# EAGLE design IR_blaster (EAGLE 7.6.0)
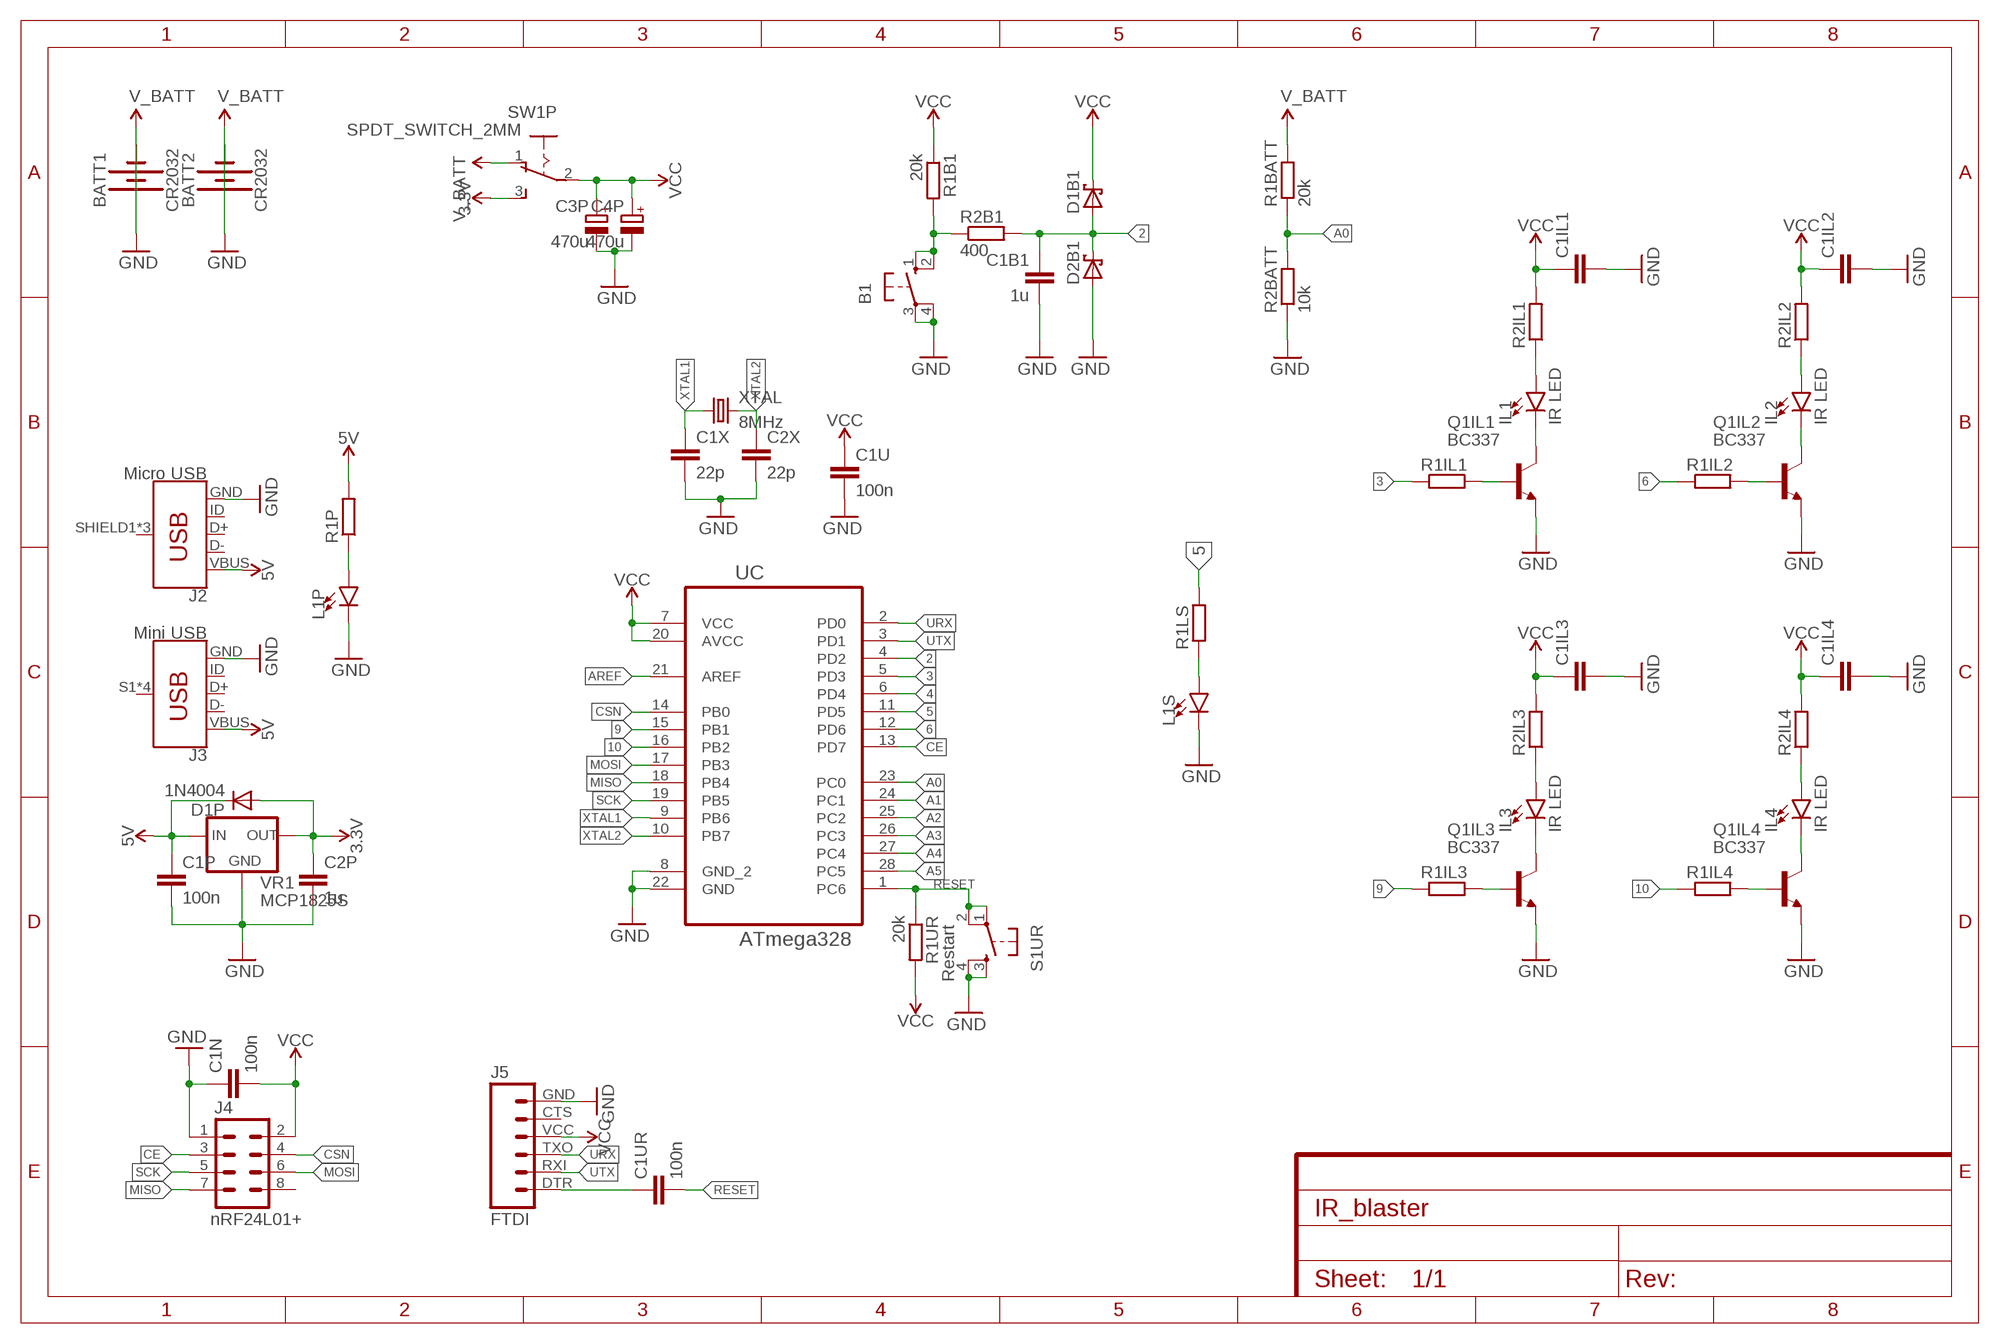
[diagram p0: schematic, sheet 1]

## Parts
B1  40-XX  [B3F-40XX]
BATT1  CR2032  BATTERY-20MM_PTH  [BATTCOM_20MM_PTH]
BATT2  CR2032  BATTERY-20MM_PTH  [BATTCOM_20MM_PTH]
C1B1  1u  C-EU050-050X075  [C050-050X075]
C1IL1  C-EU050-050X075  [C050-050X075]
C1IL2  C-EU050-050X075  [C050-050X075]
C1IL3  C-EU050-050X075  [C050-050X075]
C1IL4  C-EU050-050X075  [C050-050X075]
C1N  100n  C-EU025-025X050  [C025-025X050]
C1P  100n  C-EU050-025X075  [C050-025X075]
C1U  100n  C-EU050-025X075  [C050-025X075]
C1UR  100n  C-EU050-025X075  [C050-025X075]
C1X  22p  C-EU025-025X050  [C025-025X050]
C2P  1u  C-EU050-050X075  [C050-050X075]
C2X  22p  C-EU025-025X050  [C025-025X050]
C3P  470u  CPOL-EUE5-8.5  [E5-8,5]
C4P  470u  CPOL-EUE5-8.5  [E5-8,5]
D1B1  SCHOTTKY-DIODEDO41-7  [DO41-7]
D1P  1N4004  [DO41-10]
D2B1  SCHOTTKY-DIODEDO41-7  [DO41-7]
IL1  IR LED  LED-IRTSAL6100  [LED_5MM]
IL2  IR LED  LED-IRTSAL6100  [LED_5MM]
IL3  IR LED  LED-IRTSAL6100  [LED_5MM]
IL4  IR LED  LED-IRTSAL6100  [LED_5MM]
J2  Micro USB  USB_MICRO-B_FEMALE-SMT  [USB-B-MICRO-SMD]
J3  Mini USB  USB_MINI-B_SMT  [USB-MINIB]
J4  nRF24L01+  M04X2  [2X4]
J5  FTDI  FTDI_BASICPTH  [FTDI_BASIC]
L1P  LED3MM  [LED_3MM]
L1S  LED3MM  [LED_3MM]
Q1IL1  BC337  [TO92]
Q1IL2  BC337  [TO92]
Q1IL3  BC337  [TO92]
Q1IL4  BC337  [TO92]
R1B1  20k  R-EU_0207/7  [0207/7]
R1BATT  20k  R-EU_0207/7  [0207/7]
R1IL1  R-EU_0207/7  [0207/7]
R1IL2  R-EU_0207/7  [0207/7]
R1IL3  R-EU_0207/7  [0207/7]
R1IL4  R-EU_0207/7  [0207/7]
R1LS  R-EU_0207/7  [0207/7]
R1P  R-EU_0207/7  [0207/7]
R1UR  20k  R-EU_0207/7  [0207/7]
R2B1  400  R-EU_0207/7  [0207/7]
R2BATT  10k  R-EU_0207/7  [0207/7]
R2IL1  R-EU_0207/7  [0207/7]
R2IL2  R-EU_0207/7  [0207/7]
R2IL3  R-EU_0207/7  [0207/7]
R2IL4  R-EU_0207/7  [0207/7]
S1UR  Restart  TAC_SWITCHPTH  [TACTILE-PTH]
SW1P  SPDT_SWITCH_2MM  [SWITCH_2MM]
UC  ATmega328  ATMEGA328P-PU  [DIP254P762X457-28]
VR1  MCP1825S  78XXL  [78XXL]
XTAL  8MHz  CRYSTALHC49S  [HC49/S]

## Nets
2: C1B1.1 D1B1.A D2B1.C R2B1.2 UC.4(PD2)
3: R1IL1.1 UC.5(PD3)
3.3V: C2P.1 D1P.A SW1P.3 VR1.OUT
4: UC.6(PD4)
5: R1LS.2 UC.11(PD5)
5V: C1P.1 D1P.C J2.VBUS J3.VBUS R1P.2 VR1.IN
6: R1IL2.1 UC.12(PD6)
9: R1IL3.1 UC.15(PB1)
10: R1IL4.1 UC.16(PB2)
A0: R1BATT.1 R2BATT.2 UC.23(PC0)
A1: UC.24(PC1)
A2: UC.25(PC2)
A3: UC.26(PC3)
A4: UC.27(PC4)
A5: UC.28(PC5)
AREF: UC.21(AREF)
CE: J4.3 UC.13(PD7)
CSN: J4.4 UC.14(PB0)
GND: B1.3(P) B1.4(P1) BATT1.2(-) BATT2.2(-) C1B1.2 C1IL1.2 C1IL2.2 C1IL3.2 C1IL4.2 C1N.1 C1P.2 C1U.2 C1X.2 C2P.2 C2X.2 C3P.- C4P.- D2B1.A J2.GND J3.GND J4.1 J5.GND L1P.K(C) L1S.K(C) Q1IL1.1(E) Q1IL2.1(E) Q1IL3.1(E) Q1IL4.1(E) R2BATT.1 S1UR.3 S1UR.4 UC.8(GND_2) UC.22(GND) VR1.GND
MISO: J4.7 UC.18(PB4)
MOSI: J4.6 UC.17(PB3)
N$1: L1S.A R1LS.1
N$2: L1P.A R1P.1
N$4: IL1.K(C) Q1IL1.3(C)
N$5: IL1.A R2IL1.1
N$6: Q1IL1.2(B) R1IL1.2
N$7: C1UR.1 J5.DTR
N$8: IL2.K(C) Q1IL2.3(C)
N$9: IL2.A R2IL2.1
N$10: Q1IL2.2(B) R1IL2.2
N$11: IL3.K(C) Q1IL3.3(C)
N$12: IL3.A R2IL3.1
N$13: Q1IL3.2(B) R1IL3.2
N$14: IL4.K(C) Q1IL4.3(C)
N$15: IL4.A R2IL4.1
N$16: Q1IL4.2(B) R1IL4.2
N$17: B1.1(S) B1.2(S1) R1B1.2 R2B1.1
RESET: C1UR.2 R1UR.1 S1UR.1 S1UR.2 UC.1(PC6)
SCK: J4.5 UC.19(PB5)
URX: J5.TXO UC.2(PD0)
UTX: J5.RXI UC.3(PD1)
V_BATT: BATT1.1(+) BATT2.1(+) R1BATT.2 SW1P.1
VCC: C1IL1.1 C1IL2.1 C1IL3.1 C1IL4.1 C1N.2 C1U.1 C3P.+ C4P.+ D1B1.C J4.2 J5.VCC R1B1.1 R1UR.2 R2IL1.2 R2IL2.2 R2IL3.2 R2IL4.2 SW1P.2 UC.7(VCC) UC.20(AVCC)
XTAL1: C1X.1 UC.9(PB6) XTAL.1
XTAL2: C2X.1 UC.10(PB7) XTAL.2
Unconnected: J2.D+ J2.D- J2.ID J2.SHIELD1(SHIELD) J2.SHIELD2(SHIELD) J2.SHIELD3(SHIELD) J3.D+ J3.D- J3.ID J3.S1(SHIELD) J3.S2(SHIELD) J3.S3(SHIELD) J3.S4(SHIELD) J4.8 J5.CTS

## Library data of the parts
B1 = switch-omron:40-XX: OMRON SWITCH; MF: OMRON COMPONENTS USA; MPN: B3F-4000; OC_FARNELL: 176434; OC_NEWARK: 36K3105
BATT1 BATT2 = SparkFun-Batteries:BATTERY: Battery - Single Cell A variety of battery chemistries, sizes, and footprints. Device List: 20MM_PTH - Coin Cell Battery Holder - 20mm (PTH) <https://www.sparkfun.com/products/783> 12MM_SMD - Coin Cell Battery Holder - 12mm (SMD) <https://www.sparkfun.com/products/10592> 12MM_PTH - Coin Cell Battery Holder - 12mm (PTH) <https://www.sparkfun.com/products/7948> 20MM_SMD - 20mm Coin Cell Battery Holder (SMD) (2 legs) Used on the Big Time Watch Kit <https://www.sparkfun.com/products/11734> 20MM_SMD_4LEGS - Coin Cell Battery Holder - 20mm (SMD) <https://www.sparkfun.com/products/11892> 20MM_SMD_4LEGS_OVERPASTE - Coin Cell Battery Holder - 20mm (SMD) <https://www.sparkfun.com/products/11892> (Over-paste on the legs) 24.5MM_PTH - Coin Cell Battery Holder - 24.5mm (PTH) <https://www.sparkfun.com/products/8863> 9V - 9V Battery Holder - PC Mount Used on the SparkFun SparkPunk Sound Kit <https://www.sparkfun.com/products/11177> and SparkFun SparkPunk Sequencer Kit <https://www.sparkfun.com/products/12707> 18650 - Battery Holder - 18650 (PTH) <https://www.sparkfun.com/products/13113> AA - Battery Holder - 1xAA (PTH) <https://www.sparkfun.com/products/7949> AAA - Battery Holder - 1xAAA (PTH) <https://www.sparkfun.com/products/12718> AA_KIT - Battery Holder - 1xAA (PTH) <https://www.sparkfun.com/products/7949> Special kit package - pads only have exposed copper on one side of the board. AAA_KIT - Battery Holder - 1xAAA (PTH) <https://www.sparkfun.com/products/12718> Special kit package - pads only have exposed copper on one side of the board.; PROD_ID: BATT-09031; SF_SKU: PRT-00783
C1B1 C1IL1-C1IL4 C1N C1P C1U C1UR C1X C2P C2X = resistor:C-EU: CAPACITOR, European symbol
C3P C4P = resistor:CPOL-EU: POLARIZED CAPACITOR, European symbol
D1B1 D2B1 = adafruit:SCHOTTKY-DIODE: Schottky Diode
D1P = adafruit:1N4004: DIODE General purpose 1N400x type rectifier (With bigger pads) http://www.ladyada.net/library/pcb/eaglelibrary.html
IL1-IL4 = SparkFun-LED:LED-IR: Infrared LED (IR) Wavelength: 940nm Packages: TSAL6100 LTE302 - Side firing. Check SparkFun-Sensors.lbr for the receiver SparkFun Products: ZX Distance and Gesture Sensor <[https://www.sparkfun.com/products/12780]> Infrared Emitters and Detectors <https://www.sparkfun.com/products/241>; PROD_ID: DIO-12058
J2 = SparkFun-Connectors:USB_MICRO-B: USB Type Micro-B Connector Male/female and PTH/SMT variants SparkFun Products: SparkFun microB USB Breakout <https://www.sparkfun.com/products/12035> SparkFun USB microB Plug Breakout <https://www.sparkfun.com/products/10031> SparkFun ESP8266 Thing <https://www.sparkfun.com/products/13231>; PROD_ID: CONN-11752
J3 = SparkFun-Connectors:USB_MINI-B: USB type Mini-B Connector Breaks out 5th pin, and includes shield pins if needed. SparkFun Products: SparkFun FTDI Basic Breakout <https://www.sparkfun.com/products/9716> SparkFun XBee Explorer USB <https://www.sparkfun.com/products/11812> SparkFun Redboard <https://www.sparkfun.com/products/12757>; PROD_ID: CONN-08193; SF_ID: PRT-00587
J4 = SparkFun-Connectors:M04X2: .1" header, two rows of four.; MF: OLIMEX; MPN: MOD-NRF24LR; OC_FARNELL: 1701547
J5 = SparkFun-Connectors:FTDI_BASIC: FTDI Basic header with labels
L1P L1S = SparkFun-LED:LED: LED (Generic) Standard schematic elements and footprints for 5mm, 3mm, 1206, and 0603 sized LEDs. Generic LEDs with no color specified.; PROD_ID: DIO-08794
Q1IL1-Q1IL4 = transistor-npn:BC337*: NPN Transistor
R1B1 R1BATT R1IL1-R1IL4 R1LS R1P R1UR R2B1 R2BATT R2IL1-R2IL4 = resistor:R-EU_: RESISTOR, European symbol
S1UR = SparkFun:TAC_SWITCH: Momentary Switch Button commonly used for reset or general input. Spark Fun Electronics SKU : COM-00097
SW1P = VaSe7u - Switches:SPDT_SWITCH_2MM: SPDT switch, 2mm pitch with mounting holes.
UC = Atmel by Element14 (batch 1):ATMEGA328P-PU: 8-bit Microcontroller with In-System Programmable Flash; MPN: ATMEGA328P-PU; OC_FARNELL: 1715487; OC_NEWARK: 15R0268; PACKAGE: PDIP-28; SUPPLIER: Atmel
VR1 = v-reg:78XXL: VOLTAGE REGULATOR
XTAL = crystal:CRYSTAL: CRYSTAL; OC_FARNELL: 1667008; OC_NEWARK: unknown

## Board
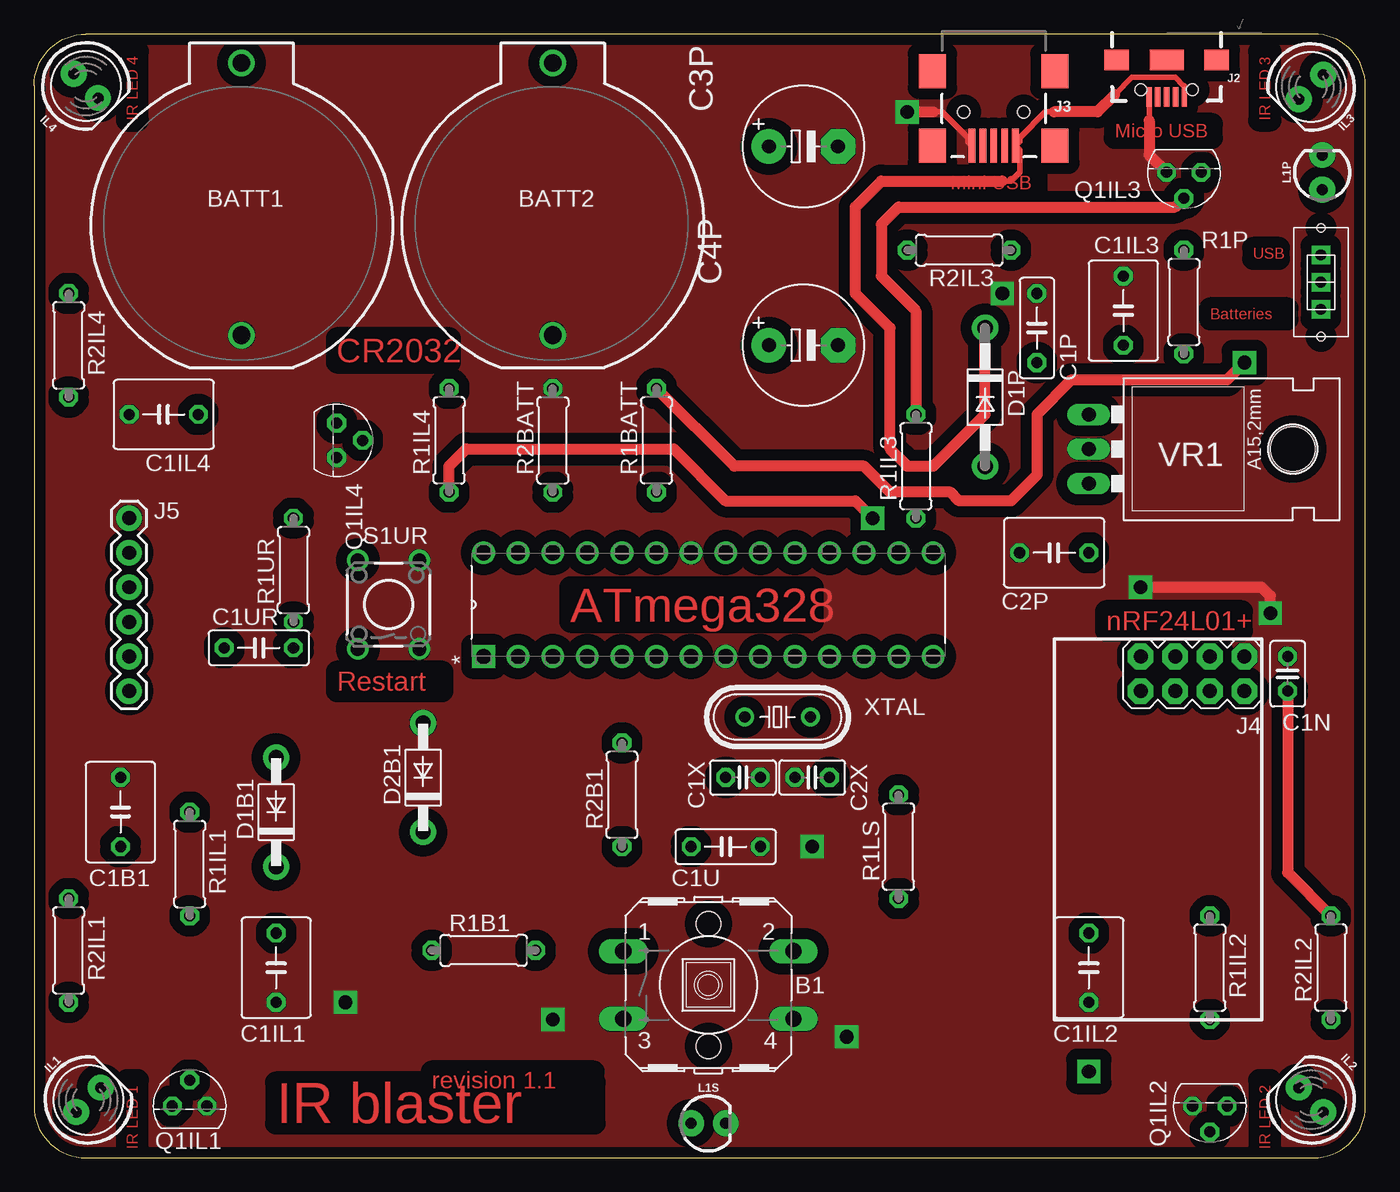
[diagram p1: board, top side]
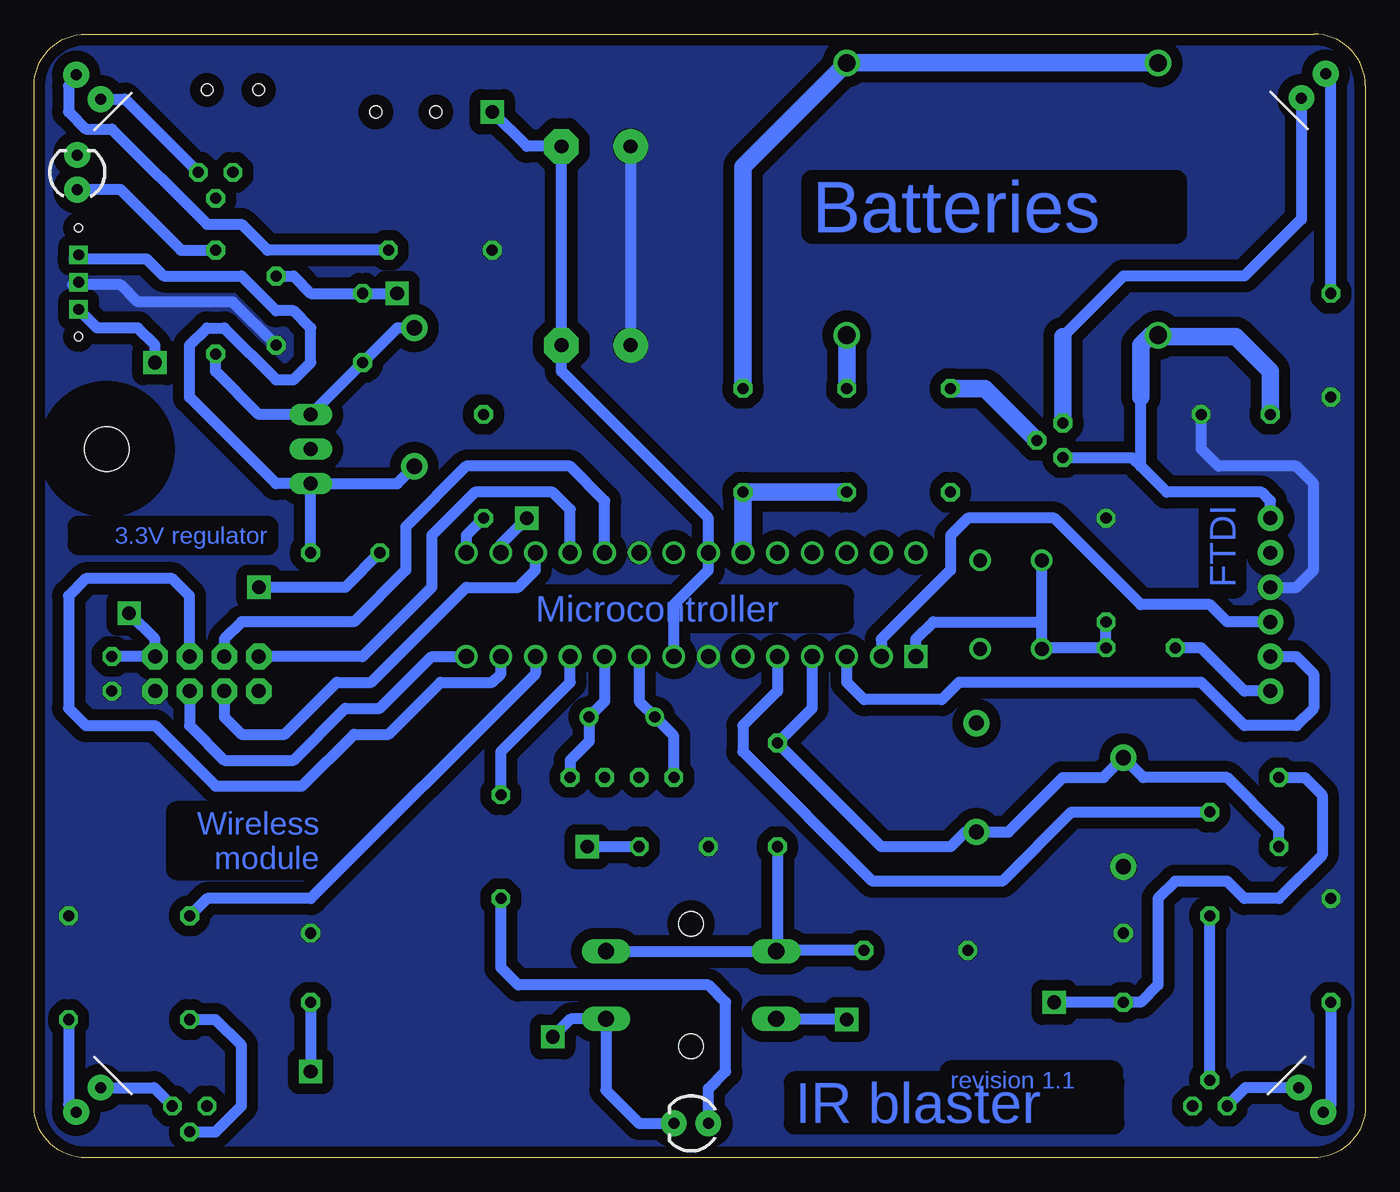
[diagram p2: board, bottom side, seen from below]

Size 97.79 x 82.55 mm. Coordinates in mm from the lower left corner, seen from the top.
Outline: 0,3.81 arc90 3.81,0 93.98,0 arc90 97.79,3.81 97.79,78.74 arc90 93.98,82.55 3.81,82.55 arc90 0,78.74 0,3.81
Copper layers (1*16): Top 0.035mm / dielectric 1.5mm / Bottom 0.035mm
Design rules "VaSe7u - Toner transfer method *": minimum track width 16mil, minimum drill 0.8mm, track to track 12mil, track to pad 12mil, pad to pad 10mil, via to via 12mil, smd to smd 8mil, copper to edge 20mil, drill to drill 8mil, minimum pad ring 11mil, minimum via ring 14mil, stop-mask expansion 4mil, vias tented up to drill 0mil, thermal gap 2mil

### Footprints (pad centres in the part's own frame; a part is rotated, then mirrored left to right if it is on the bottom)
B3F-40XX = drill 1.194 long: 1 -6.248,2.489; 2 6.248,2.489; 3 -6.248,-2.489; 4 6.248,-2.489 | hole 1.803: 0,-4.496; 0,4.496
BATTCOM_20MM_PTH = drill 1.3: 1 11.85,0; 2 -8.15,0
C050-050X075 = drill 0.813 octagon: 1 -2.54,0; 2 2.54,0
C025-025X050 = drill 0.813 octagon: 1 -1.27,0; 2 1.27,0
C050-025X075 = drill 0.813 octagon: 1 -2.54,0; 2 2.54,0
E5-8,5 = drill 1.016 pad 2.54: + -2.54,0 | drill 1.016 pad 2.54 octagon: - 2.54,0
DO41-7 = drill 1.118 pad 1.93: A 4,0; C -4,0
DO41-10 = drill 1.118 pad 1.93: A 5.08,0; C -5.08,0
LED_5MM = drill 0.813 pad 1.88: A -1.27,0; K 1.27,0
USB-B-MICRO-SMD = smd 1.45 x 0.4: D+ 2.725,0; D- 2.725,0.65; GND 2.725,-1.3; ID 2.725,-0.65; VBUS 2.725,1.3 | smd 1.5 x 1.8: SHIELD1 0,3.685; SHIELD2 0,-3.685 | smd 1.5 x 2.5: SHIELD3 0,0 | hole 0.85: 2.2,1.9; 2.2,-1.9
USB-MINIB = smd 2.5 x 0.5: D+ 2.5,0; D- 2.5,0.8; GND 2.5,-1.6; ID 2.5,-0.8; VBUS 2.5,1.6 | smd 2.5 x 2: S1 -3,4.5; S2 2.5,4.5; S3 -3,-4.5; S4 2.5,-4.5 | hole 0.9: 0,2.2; 0,-2.2
2X4 = drill 1.016 pad 1.88 octagon: 1 -3.81,-1.27; 2 -3.81,1.27; 3 -1.27,-1.27; 4 -1.27,1.27; 5 1.27,-1.27; 6 1.27,1.27; 7 3.81,-1.27; 8 3.81,1.27
FTDI_BASIC = drill 1.016 pad 1.88: CTS 10.16,0; DTR 0,0; GND 12.7,0; RXI 2.54,0; TXO 5.08,0; VCC 7.62,0
LED_3MM = drill 0.813 pad 1.88: A -1.27,0; K 1.27,0
TO92 = drill 0.813 octagon: 1 1.27,0; 2 0,1.905; 3 -1.27,0
0207/7 = drill 0.813 octagon: 1 -3.81,0; 2 3.81,0
TACTILE-PTH = drill 1.016: 1 -3.251,2.261; 2 3.251,2.261; 3 -3.251,-2.261; 4 3.251,-2.261
SWITCH_2MM = drill 0.8 square: 1 2,2; 2 4,2; 3 6,2 | hole 0.6: 0,2; 8,2
DIP254P762X457-28 = drill 1.118 square: 1 -7.62,33.02 | drill 1.118: 2 -7.62,30.48; 3 -7.62,27.94; 4 -7.62,25.4; 5 -7.62,22.86; 6 -7.62,20.32; 7 -7.62,17.78; 8 -7.62,15.24; 9 -7.62,12.7; 10 -7.62,10.16; 11 -7.62,7.62; 12 -7.62,5.08; 13 -7.62,2.54; 14 -7.62,0; 15 0,0; 16 0,2.54; 17 0,5.08; 18 0,7.62; 19 0,10.16; 20 0,12.7; 21 0,15.24; 22 0,17.78; 23 0,20.32; 24 0,22.86; 25 0,25.4; 26 0,27.94; 27 0,30.48; 28 0,33.02
78XXL = drill 1.016 long: GND 0,-3.81; IN -2.54,-3.81; OUT 2.54,-3.81 | hole 3.302: 0,11.176
HC49/S = drill 0.813: 1 -2.413,0; 2 2.413,0

### Placement (x,y rotation side)
B1  49.53,12.7 0 top
BATT1  15.24,68.58 90 top
BATT2  38.1,68.58 90 top
C1B1  6.35,25.4 90 top
C1IL1  17.78,13.97 270 top
C1IL2  77.47,13.97 270 top
C1IL3  80.01,62.23 90 top
C1IL4  9.53,54.61 180 top
C1N  92.08,35.56 270 top
C1P  73.66,60.96 90 top
C1U  50.8,22.86 0 top
C1UR  16.51,37.47 0 top
C1X  52.07,27.94 0 top
C2P  74.93,44.45 180 top
C2X  57.15,27.94 180 top
C3P  56.52,74.3 0 top
C4P  56.52,59.69 0 top
D1B1  17.78,25.4 90 top
D1P  69.85,55.88 270 top
D2B1  28.57,27.94 90 top
IL1  4,4.26 45 top
IL2  93.79,4.26 135 top
IL3  93.79,78.66 225 top
IL4  3.81,78.74 315 top
J2  83.19,80.64 270 top
J3  70.48,76.83 270 top
J4  85.09,35.56 180 top
J5  6.99,34.29 90 top
L1P  94.61,72.39 90 top
L1S  49.53,2.54 0 top
Q1IL1  11.43,3.81 0 top
Q1IL2  86.36,3.81 180 top
Q1IL3  84.45,72.39 180 top
Q1IL4  22.23,52.7 270 top
R1B1  33.02,15.24 0 top
R1BATT  45.72,52.7 90 top
R1IL1  11.43,21.59 270 top
R1IL2  86.36,13.97 270 top
R1IL3  64.77,50.8 90 top
R1IL4  30.48,52.7 90 top
R1LS  63.5,22.86 90 top
R1P  84.45,62.87 270 top
R1UR  19.05,43.18 90 top
R2B1  43.18,26.67 90 top
R2BATT  38.1,52.7 270 top
R2IL1  2.54,15.24 90 top
R2IL2  95.25,13.97 90 top
R2IL3  67.94,66.67 180 top
R2IL4  2.54,59.69 270 top
S1UR  26.04,40.64 90 top
SW1P  96.52,60.33 90 top
UC  66.04,44.45 90 top
VR1  81.28,52.07 270 top
XTAL  54.61,32.38 0 top

### Tracks (layer width: path | path; a pad name or v marks a point on that pad's centre or on a via)
2
  Bottom 0.813: UC.4 40.64,33.02 R2B1.2 35.56,22.86 30.48,22.86 29.4,23.94 D2B1.C 26.23,23.94 22.23,27.94 19.24,27.94 D1B1.A | 17.59,29.21 D1B1.A | C1B1.1 6.35,24.13 10.16,27.94 16.32,27.94 D1B1.A
3
  Bottom 0.813: UC.5 43.18,34.29 45.72,31.75 45.72,29.84 36.2,20.32 26.67,20.32 21.59,25.4 R1IL1.1
3.3V
  Bottom 0.813: C2P.1 VR1.OUT | VR1.OUT 71.12,49.53 D1P.A | VR1.OUT 80.01,49.53 86.36,55.88 86.36,59.69 85.09,60.96 83.82,60.96 80.01,57.15 78.74,57.15 77.47,58.42 77.47,60.96 78.74,62.23 80.01,62.23 82.55,64.77 88.27,64.77 89.53,66.04 94.87,66.04 SW1P.3
5
  Bottom 0.813: R1LS.2 63.5,29.84 58.42,34.92 UC.11
5V
  Top 0.406: J2.VBUS 84.48,78.77 84.42,78.77 83.82,79.38 80.64,79.38 79.38,78.11 | 71.12,71.75 71.75,71.75 72.39,72.39 72.39,74.03 J3.VBUS 72.39,74.64 72.39,74.93 74.3,76.83 74.93,76.83
  Top 0.813: D1P.C 69.85,54.61 66.04,50.8 64.14,50.8 62.87,52.07 62.87,60.96 60.33,63.5 60.33,69.85 62.23,71.75 71.12,71.75 | 74.93,76.83 78.11,76.83 79.38,78.11
  Bottom 0.813: D1P.C 71.12,60.96 C1P.1 VR1.IN 81.28,54.61 84.45,57.78 R1P.2
6
  Bottom 0.813: R1IL2.1 85.09,19.05 77.47,19.05 60.96,35.56 UC.12
9
  Bottom 0.813: R1IL3.1 66.04,45.72 UC.15
10  (via drill 1)
  Top 0.813: R1IL4.1 30.48,50.8 31.75,52.07 46.99,52.07 50.8,48.26 60.33,48.26 v61.59,46.99
  Bottom 0.813: UC.16 63.5,45.09 v61.59,46.99
A0
  Bottom 1.27: R2BATT.2 R1BATT.1 UC.23
CE
  Bottom 0.813: UC.13 63.5,35.56 64.14,34.92 67.94,34.92 71.75,31.11 74.3,31.11 78.11,27.3 84.45,27.3 88.9,31.75 93.98,31.75 95.25,33.02 95.25,41.27 93.98,42.55 87.63,42.55 86.36,41.27 J4.3
CSN
  Bottom 0.813: J4.4 86.36,31.75 83.82,29.21 78.74,29.21 74.93,33.02 72.39,33.02 68.58,36.83 UC.14
GND  (via drill 1)
  Top 0.406: 81.92,76.2 81.92,77.89 J2.GND | 66.04,76.83 66.67,76.83 68.58,74.93 68.58,74.64 J3.GND
  Top 0.813: 81.92,76.2 81.92,73.66 Q1IL3.1 | v64.14,76.83 66.04,76.83 | v90.81,40.01 90.81,41.27 90.17,41.91 v81.28,41.91
  Bottom 0.813: v64.14,76.83 61.59,74.3 C3P.- C4P.- 59.05,57.78 48.26,46.99 UC.22 48.26,43.18 50.8,40.64 UC.8 | J5.GND 6.99,48.26 7.62,48.9 14.61,48.9 16.51,50.8 | 16.51,50.8 16.51,55.88 | Q1IL4.1 17.14,51.44 16.51,50.8 | C1IL3.2 78.74,64.77 77.47,63.5 C1P.2 v71.12,63.5 | C2P.2 74.93,41.91 v81.28,41.91 | C1U.2 v57.15,22.86 | C1IL2.2 77.47,6.35 | C1N.1 J4.1 88.9,38.1 v90.81,40.01 | L1S.K 53.34,2.54 55.78,4.98 B1.4 58.37,10.21 v59.69,8.89 | B1.3 38.15,10.21 v38.1,10.16 | v22.86,11.43 C1IL1.2 16.51,11.43 15.24,12.7 15.24,19.05 13.97,20.32 10.16,20.32 8.89,19.05 6.35,19.05 3.17,22.23 3.17,26.67 4.45,27.94 C1B1.2
  Bottom 1.27: 16.51,55.88 16.51,59.69 15.77,60.43 BATT1.2 15.13,60.33 9.53,60.33 6.99,57.78 C1IL4.2 | BATT2.2 R2BATT.1
  pour Top (isolate 0.813): -2.54,85.09 102.87,85.09 102.87,-5.08 -2.54,-5.08
MISO
  Bottom 0.813: UC.18 58.42,47.62 59.69,48.9 65.41,48.9 68.58,45.72 68.58,41.91 73.66,36.83 J4.7
MOSI
  Bottom 0.813: UC.17 60.96,43.18 62.23,41.91 66.04,41.91 73.03,34.92 75.56,34.92 79.38,31.11 82.55,31.11 83.82,32.38 J4.6
N$1
  Bottom 0.813: L1S.A 48.26,5.08 46.99,6.35 46.99,11.43 48.26,12.7 62.23,12.7 63.5,13.97 R1LS.1
N$2
  Bottom 0.813: R1P.1 87,66.67 91.44,71.12 L1P.A
N$4
  Bottom 0.813: IL1.K 8.81,5.16 Q1IL1.3
N$5
  Bottom 0.813: R2IL1.1 2.54,3.92 IL1.A
N$6
  Bottom 0.813: Q1IL1.2 R1IL1.2
N$7
  Bottom 0.813: J5.DTR 8.89,34.29 12.06,37.47 C1UR.1
N$8
  Bottom 0.813: IL2.K 88.98,5.16 Q1IL2.3
N$9
  Bottom 0.813: R2IL2.1 95.25,3.92 IL2.A
N$10
  Bottom 0.813: Q1IL2.2 84.45,1.91 82.55,3.81 82.55,8.26 84.45,10.16 R1IL2.2
N$11
  Bottom 0.813: IL3.K 91.1,77.77 Q1IL3.3
N$12
  Bottom 0.813: R2IL3.1 80.64,66.67 82.55,68.58 85.09,68.58 92.08,75.56 93.98,75.56 95.25,76.83 95.25,78.74 94.69,79.3 IL3.A
N$13
  Top 0.813: R1IL3.2 64.77,62.23 62.23,64.77 62.23,68.58 63.5,69.85 83.82,69.85 Q1IL3.2
N$14
  Bottom 0.813: IL4.K 4.71,68.95 8.89,64.77 17.78,64.77 22.23,60.33
  Bottom 1.27: Q1IL4.3 22.23,60.33
N$15
  Bottom 0.813: R2IL4.1 2.54,79.27 IL4.A
N$16
  Bottom 1.27: R1IL4.2 27.94,56.52 Q1IL4.2
N$17
  Bottom 0.813: B1.2 B1.1 | R1B1.2 43.23,15.24 B1.1 | R2B1.1 43.18,15.29 B1.1
N$18  (via drill 1)
  other vias: 77.47,6.35
RESET
  Bottom 0.813: 23.77,39.37 S1UR.1 23.7,37.47 C1UR.2 R1UR.1 | 23.77,39.37 S1UR.2 | UC.1 33.02,38.1 31.75,39.37 23.77,39.37
SCK
  Bottom 0.813: UC.19 55.88,48.26 58.42,50.8 66.04,50.8 70.48,46.35 70.48,43.18 74.3,39.37 82.55,39.37 83.82,38.1 J4.5
URX
  Bottom 0.813: J5.TXO 10.16,39.37 11.43,40.64 16.51,40.64 22.86,46.99 29.21,46.99 30.48,45.72 30.48,43.18 35.56,38.1 UC.2
UTX
  Bottom 0.813: J5.RXI 5.08,36.83 3.81,35.56 3.81,33.02 5.08,31.75 8.89,31.75 12.06,34.92 29.84,34.92 31.11,33.66 36.83,33.66 38.1,34.92 UC.3 38.1,36.2
V_BATT  (via drill 1)
  Top 0.813: v88.9,58.42 87.63,57.15 76.2,57.15 73.66,54.61 73.66,50.16 71.75,48.26 67.94,48.26 67.31,48.9 62.87,48.9 60.96,50.8 51.44,50.8 R1BATT.2
  Bottom 0.813: v88.9,58.42 88.9,59.69 90.17,60.96 93.16,60.96 SW1P.1
  Bottom 1.27: BATT1.1 BATT2.1 45.72,72.81 R1BATT.2
VCC
  Top 0.813: C1N.2 92.08,20.95 R2IL2.2
  Bottom 0.813: J5.VCC 5.08,41.91 3.81,43.18 3.81,49.53 5.08,50.8 10.79,50.8 12.06,52.07 C1IL4.1 | C3P.+ C4P.+ | SW1P.2 94.97,64.14 91.44,64.14 90.17,62.87 83.19,62.87 C1IL3.1
  pour Bottom (isolate 0.813): -5.08,87.63 100.33,87.63 100.33,-2.54 -5.08,-2.54
XTAL1
  Bottom 0.813: UC.9 53.34,33.53 XTAL.1 50.8,30.99 C1X.1
XTAL2
  Bottom 0.813: UC.10 55.88,33.53 XTAL.2 57.02,30.61 58.42,29.21 C2X.1

### Text on the board
Top: IR LED 4 | IR LED 3 | Micro USB | Mini USB | USB | Batteries | CR2032 | ATmega328 | nRF24L01+ | Restart | revision 1.1 | IR blaster | IR LED 1 | IR LED 2
Bottom: Batteries | 3.3V regulator | FTDI | Microcontroller | Wireless / module | revision 1.1 | IR blaster
tCream: IR LED 4 | IR LED 3 | USB | Batteries | CR2032 | ATmega328 | Restart | revision 1.1 | IR blaster | IR LED 1 | IR LED 2